# Altium schematic sheet ADC_Channels.SchDoc: ADC Channels
size Tabloid; Date: 05/10/2023; Engineer: Terry D. Schevker; Revision: 1.0; SheetNumber: 1; SheetTotal: 7
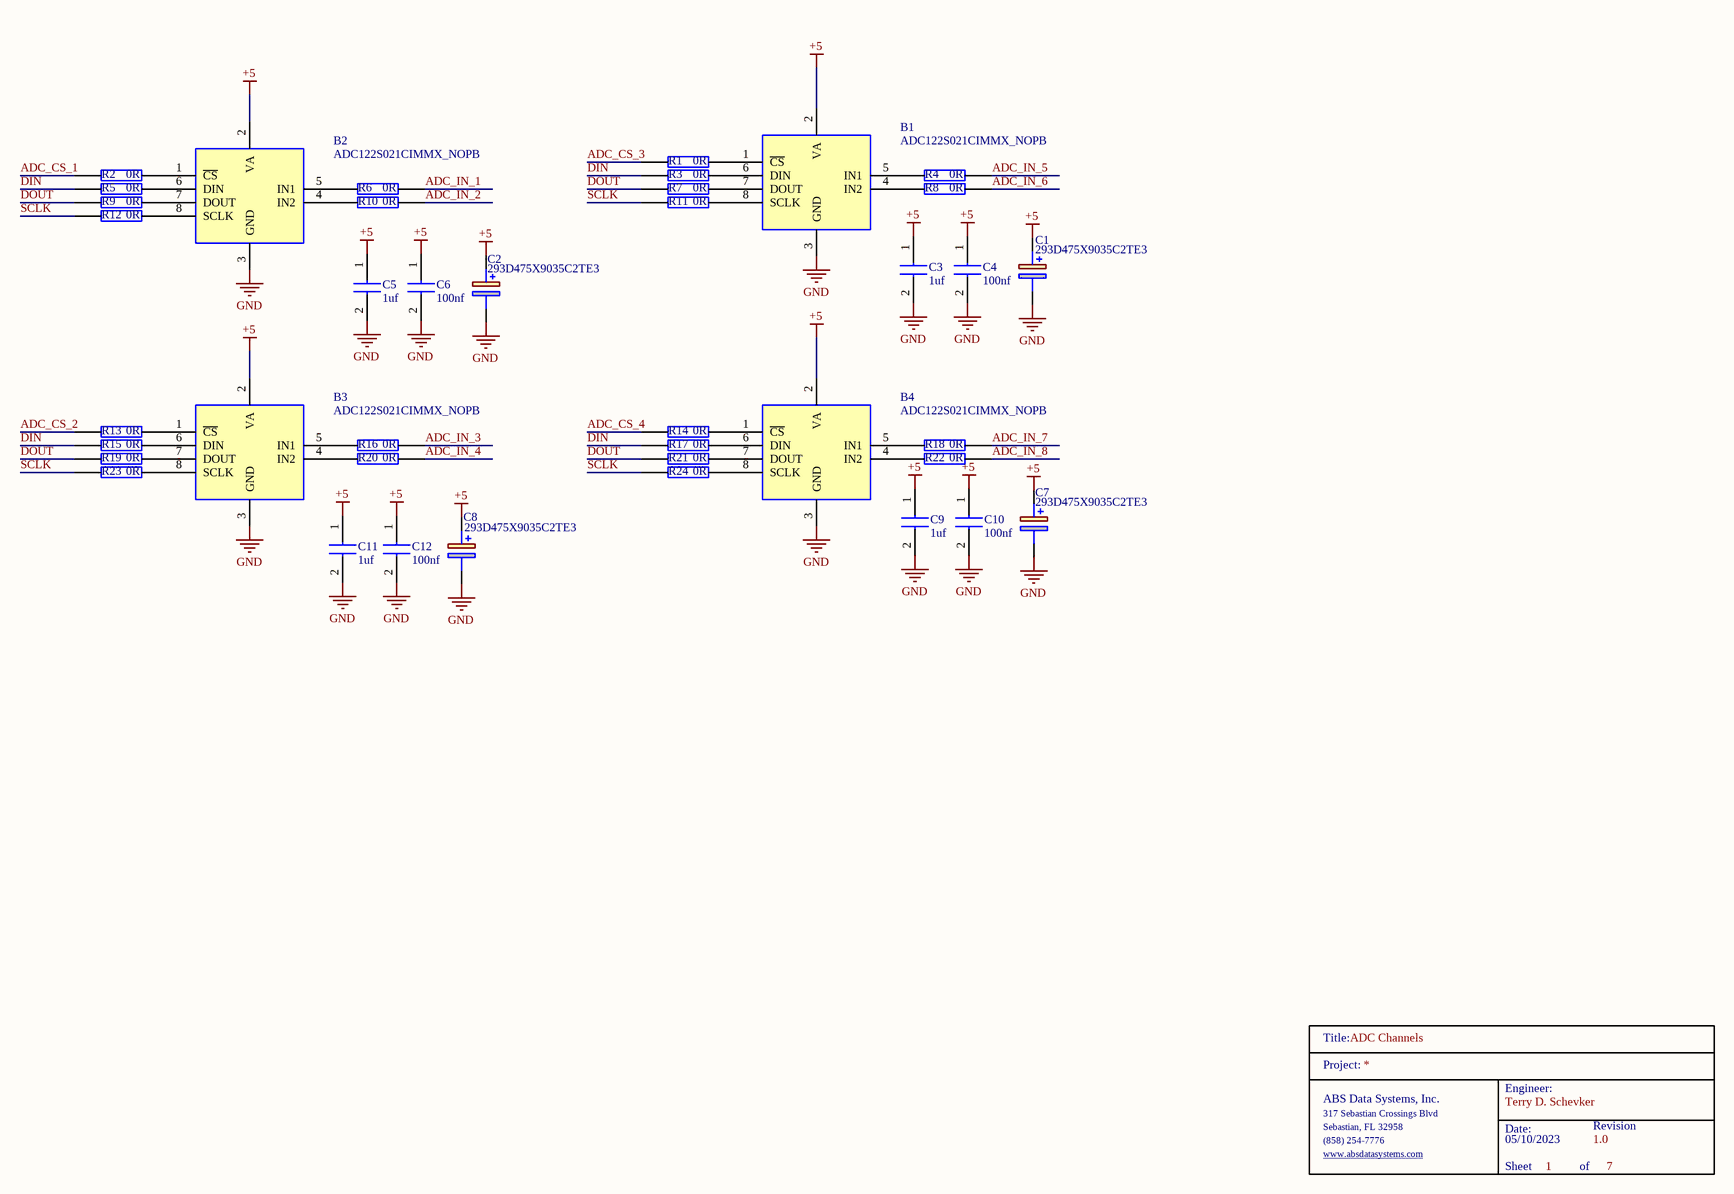
[diagram p0: ADC_Channels.SchDoc]

## Parts
B1  ADC122S021CIMMX_NOPB  [SOP65P490X110-8N]
B2  ADC122S021CIMMX_NOPB  [SOP65P490X110-8N]
B3  ADC122S021CIMMX_NOPB  [SOP65P490X110-8N]
B4  ADC122S021CIMMX_NOPB  [SOP65P490X110-8N]
C1  293D475X9035C2TE3  [CAPPM6032X280N]
C2  293D475X9035C2TE3  [CAPPM6032X280N]
C3  1uf  [0603]
C4  100nf  [0603]
C5  1uf  [0603]
C6  100nf  [0603]
C7  293D475X9035C2TE3  [CAPPM6032X280N]
C8  293D475X9035C2TE3  [CAPPM6032X280N]
C9  1uf  [0603]
C10  100nf  [0603]
C11  1uf  [0603]
C12  100nf  [0603]
R1  0R  [0603]
R2  0R  [0603]
R3  0R  [0603]
R4  0R  [0603]
R5  0R  [0603]
R6  0R  [0603]
R7  0R  [0603]
R8  0R  [0603]
R9  0R  [0603]
R10  0R  [0603]
R11  0R  [0603]
R12  0R  [0603]
R13  0R  [0603]
R14  0R  [0603]
R15  0R  [0603]
R16  0R  [0603]
R17  0R  [0603]
R18  0R  [0603]
R19  0R  [0603]
R20  0R  [0603]
R21  0R  [0603]
R22  0R  [0603]
R23  0R  [0603]
R24  0R  [0603]
TitleBlock_1  TitleBlock  (value not drawn)  (graphical)

## Nets
+5: B1.2(VA) B2.2(VA) B3.2(VA) B4.2(VA) C1.1(+) C2.1(+) C3.1 C4.1 C5.1 C6.1 C7.1(+) C8.1(+) C9.1 C10.1 C11.1 C12.1
GND: B1.3(GND) B2.3(GND) B3.3(GND) B4.3(GND) C1.2(-) C2.2(-) C3.2 C4.2 C5.2 C6.2 C7.2(-) C8.2(-) C9.2 C10.2 C11.2 C12.2
ADC_CS_1: R2.1
ADC_CS_2: R13.1
ADC_CS_3: R1.1
ADC_CS_4: R14.1
ADC_IN_1: R6.2
ADC_IN_2: R10.2
ADC_IN_3: R16.2
ADC_IN_4: R20.2
ADC_IN_5: R4.2
ADC_IN_6: R8.2
ADC_IN_7: R18.2
ADC_IN_8: R22.2
DIN: R3.1 R5.1 R15.1 R17.1
DOUT: R7.1 R9.1 R19.1 R21.1
SCLK: R11.1 R12.1 R23.1 R24.1
NetB1_1: B1.1(~{CS}) R1.2
NetB1_4: B1.4(IN2) R8.1
NetB1_5: B1.5(IN1) R4.1
NetB1_6: B1.6(DIN) R3.2
NetB1_7: B1.7(DOUT) R7.2
NetB1_8: B1.8(SCLK) R11.2
NetB2_1: B2.1(~{CS}) R2.2
NetB2_4: B2.4(IN2) R10.1
NetB2_5: B2.5(IN1) R6.1
NetB2_6: B2.6(DIN) R5.2
NetB2_7: B2.7(DOUT) R9.2
NetB2_8: B2.8(SCLK) R12.2
NetB3_1: B3.1(~{CS}) R13.2
NetB3_4: B3.4(IN2) R20.1
NetB3_5: B3.5(IN1) R16.1
NetB3_6: B3.6(DIN) R15.2
NetB3_7: B3.7(DOUT) R19.2
NetB3_8: B3.8(SCLK) R23.2
NetB4_1: B4.1(~{CS}) R14.2
NetB4_4: B4.4(IN2) R22.1
NetB4_5: B4.5(IN1) R18.1
NetB4_6: B4.6(DIN) R17.2
NetB4_7: B4.7(DOUT) R21.2
NetB4_8: B4.8(SCLK) R24.2

## Notes on the sheet
- (in symbol TitleBlock) Title:; Project:; Engineer:; ABS Data Systems, Inc.; 317 Sebastian Crossings Blvd; Sebastian, FL 32958; Date:; Revision; (858) 254-7776; www.absdatasystems.com; Sheet; of

## Library data of the parts
B1-B4 = ADC122S021CIMMX_NOPB: 2 Channel, 50 ksps to 200 ksps 12-Bit A/D Converter; Manufacturer_Name: Texas Instruments; Manufacturer_Part_Number: ADC122S021CIMMX/NOPB; Geometry.Height: 1.1mm; Mouser Part Number: 926-A122S021CIMMXNPB; Mouser Price/Stock: https://www.mouser.co.uk/ProductDetail/Texas-Instruments/ADC122S021CIMMX-NOPB/?qs=7X5t%252BdzoRHB2bC7Teu8H3A%3D%3D; Datasheet Link: http://www.ti.com/lit/gpn/ADC122S021
C1 C2 C7 C8 = 293D475X9035C2TE3: Solid Tantalum Surface Mount Chip Capacitors TANTAMOUNT(TM), Molded Case, Standard Industrial Grade; Manufacturer_Name: Vishay; Geometry.Height: 2.8mm; Mouser Part Number: 74-293D475X9035C2TE3; Mouser Price/Stock: https://www.mouser.co.uk/ProductDetail/Vishay-Sprague/293D475X9035C2TE3?qs=L4BSZja3YaK5uiX7PSIEuA%3D%3D; Manufacturer_Part_Number: 293D475X9035C2TE3; Datasheet Link: http://www.vishay.com/docs/40002/293d.pdf
C3 C5 C9 C11 = CL10B105KA8NNNL: Samsung Electro-Mechanics 0603 1uf
C4 C6 C10 C12 = CL10B104JB8NNNC: Samsung Electro-Mechanics 0603 100nf
R1-R24 = RC0603JR-070RL: YAGEO 0603 0 ohm; Manufacturer_Name: KEMET; Geometry.Height: 0.55mm; Mouser Part Number: 603-RC0603JR-070RL; Mouser Price/Stock: https://www.mouser.co.uk/ProductDetail/YAGEO/RC0603JR-070RL?qs=2cAdsCoAWRGWyPcuXgGiXQ%3D%3D; Manufacturer_Part_Number: RC0603JR-070RL; Datasheet Link: https://datasheet.datasheetarchive.com/originals/distributors/Datasheets_SAMA/902f9e387b938f871d31120f5fc1d65e.pdf